# EAGLE design Driver (EAGLE 7.7.0)

## Sheet 1 of 3: LOGIC
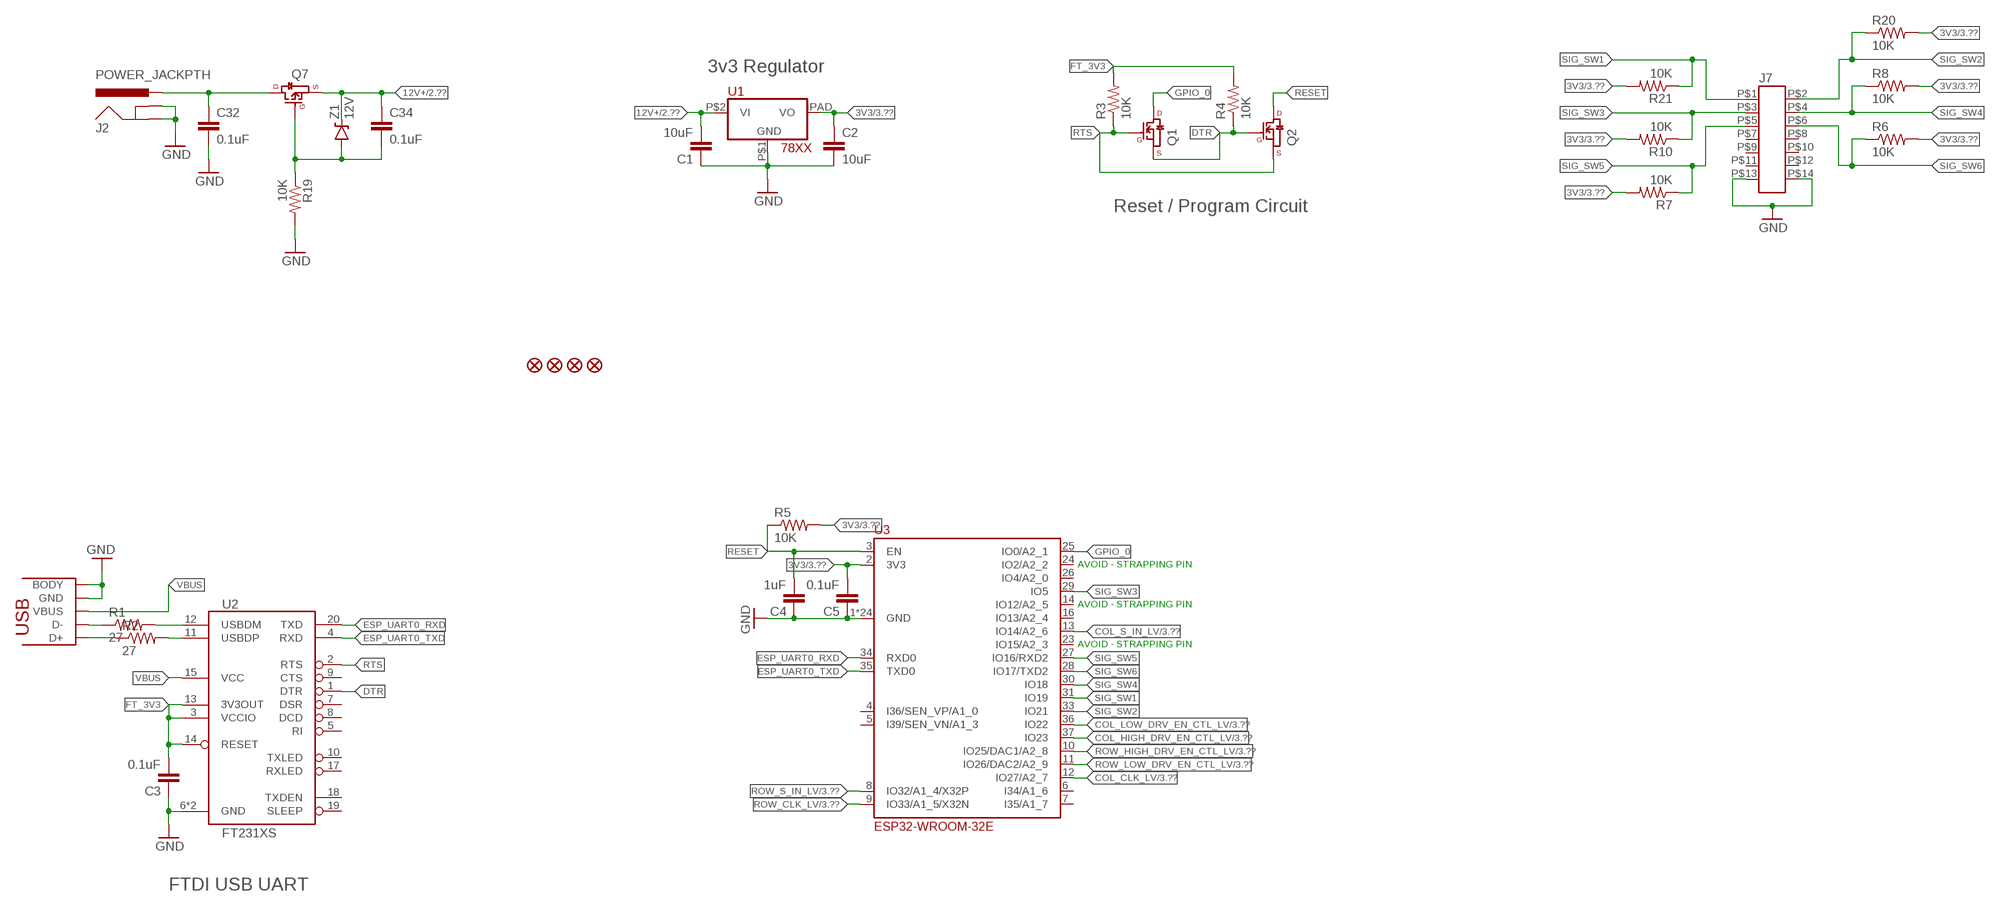
[diagram p0: schematic, sheet 1]

### Parts
C1  10uF  CAP1206  [1206]
C2  10uF  CAP1206  [1206]
C3  0.1uF  CAP0603-CAP  [0603-CAP]
C4  1uF  CAP0603-CAP  [0603-CAP]
C5  0.1uF  CAP0603-CAP  [0603-CAP]
C32  0.1uF  CAP0603-CAP  [0603-CAP]
C34  0.1uF  CAP0603-CAP  [0603-CAP]
FID1  FIDUCIAL  [FIDUCIAL]
FID2  FIDUCIAL  [FIDUCIAL]
FID3  FIDUCIAL  [FIDUCIAL]
FID4  FIDUCIAL  [FIDUCIAL]
J1  USB-MICROB  [USB-MICROB-10118192]
J2  POWER_JACKPTH  [POWER_JACK_PTH]
J7  HEADER-2X7  [3M-3000SERIES-HEADER-RIGHTANGLE]
Q1  MOSFET_N_CHANNELFDV305N  [SOT-23]
Q2  MOSFET_N_CHANNELFDV305N  [SOT-23]
Q7  MOSFET_P_CHANNELDMP4015SSS  [SO08]
R1  27  RESISTOR0603-RES  [0603-RES]
R2  27  RESISTOR0603-RES  [0603-RES]
R3  10K  RESISTOR0603-RES  [0603-RES]
R4  10K  RESISTOR0603-RES  [0603-RES]
R5  10K  RESISTOR0603-RES  [0603-RES]
R6  10K  RESISTOR0603-RES  [0603-RES]
R7  10K  RESISTOR0603-RES  [0603-RES]
R8  10K  RESISTOR0603-RES  [0603-RES]
R10  10K  RESISTOR0603-RES  [0603-RES]
R19  10K  RESISTOR0603-RES  [0603-RES]
R20  10K  RESISTOR0603-RES  [0603-RES]
R21  10K  RESISTOR0603-RES  [0603-RES]
U1  7805AZ1117_TO252  [DPAK-3]
U2  FT231XS  [SSOP-20]
U3  ESP32-WROOM-32E  [ESP32-WROOM-32E]
Z1  12V  DIODE-ZENERSOT-23  [SOT-23]

### Nets
3V3: C2.1 C5.2 R5.2 R6.2 R7.2 R8.2 R10.2 R20.2 R21.2 U1.PAD(VO) U3.2(3V3) ; also sheet 3
12V+: C1.2 C34.1 Q7.1(S) Q7.2(S) Q7.3(S) U1.P$2(VI) Z1.3(C) ; also sheet 2,3
COL_CLK_LV: U3.12(IO27/A2_7) ; also sheet 3
COL_HIGH_DRV_EN_CTL_LV: U3.37(IO23) ; also sheet 3
COL_LOW_DRV_EN_CTL_LV: U3.36(IO22) ; also sheet 3
COL_S_IN_LV: U3.13(IO14/A2_6) ; also sheet 3
DTR: Q1.2(S) Q2.1(G) R4.1 U2.1(DTR)
ESP_UART0_RXD: U2.20(TXD) U3.34(RXD0)
ESP_UART0_TXD: U2.4(RXD) U3.35(TXD0)
FT_3V3: C3.2 R3.2 R4.2 U2.3(VCCIO) U2.13(3V3OUT) U2.14(RESET)
GND: C1.1 C2.2 C3.1 C4.1 C5.1 C32.2 J1.5(GND) J1.BODY@1(BODY) J1.BODY@2(BODY) J1.BODY@3(BODY) J1.BODY@4(BODY) J1.BODY@5(BODY) J1.BODY@6(BODY) J2.GND J2.GNDBREAK J7.P$13 J7.P$14 R19.2 U1.P$1(GND) U2.6(GND) U2.16(GND) U3.1(GND) U3.15(GND) U3.38(GND) U3.P$1(GND) U3.P$2(GND) U3.P$3(GND) U3.P$4(GND) U3.P$5(GND) U3.P$6(GND) U3.P$7(GND) U3.P$8(GND) U3.P$9(GND) U3.P$10(GND) U3.P$11(GND) U3.P$12(GND) U3.PAD@1(GND) U3.PAD@2(GND) U3.PAD@3(GND) U3.PAD@4(GND) U3.PAD@5(GND) U3.PAD@6(GND) U3.PAD@7(GND) U3.PAD@8(GND) U3.PAD@9(GND) ; also sheet 2
GPIO_0: Q1.3(D) U3.25(IO0/A2_1)
N$7: J1.2(D-) R1.1
N$8: J1.3(D+) R2.1
N$17: R2.2 U2.11(USBDP)
N$18: R1.2 U2.12(USBDM)
N$25: C32.1 J2.PWR Q7.5(D) Q7.6(D) Q7.7(D) Q7.8(D)
N$27: C34.2 Q7.4(G) R19.1 Z1.1(A)
RESET: C4.2 Q2.3(D) R5.1 U3.3(EN)
ROW_CLK_LV: U3.9(IO33/A1_5/X32N) ; also sheet 3
ROW_HIGH_DRV_EN_CTL_LV: U3.10(IO25/DAC1/A2_8) ; also sheet 3
ROW_LOW_DRV_EN_CTL_LV: U3.11(IO26/DAC2/A2_9) ; also sheet 3
ROW_S_IN_LV: U3.8(IO32/A1_4/X32P) ; also sheet 3
RTS: Q1.1(G) Q2.2(S) R3.1 U2.2(RTS)
SIG_SW1: J7.P$1 R21.1 U3.31(IO19)
SIG_SW2: J7.P$2 R20.1 U3.33(IO21)
SIG_SW3: J7.P$3 R10.1 U3.29(IO5)
SIG_SW4: J7.P$4 R8.1 U3.30(IO18)
SIG_SW5: J7.P$5 R7.1 U3.27(IO16/RXD2)
SIG_SW6: J7.P$6 R6.1 U3.28(IO17/TXD2)
VBUS: J1.1(VBUS) U2.15(VCC)
Unconnected: J7.P$7 J7.P$8 J7.P$9 J7.P$10 J7.P$11 J7.P$12 U2.5(RI) U2.7(DSR) U2.8(DCD) U2.9(CTS) U2.10(TXLED) U2.17(RXLED) U2.18(TXDEN) U2.19(SLEEP) U3.4(I36/SEN_VP/A1_0) U3.5(I39/SEN_VN/A1_3) U3.6(I34/A1_6) U3.7(I35/A1_7) U3.14(IO12/A2_5) U3.16(IO13/A2_4) U3.23(IO15/A2_3) U3.24(IO2/A2_2) U3.26(IO4/A2_0)

### Notes on the sheet
- 3v3 Regulator
- Reset / Program Circuit
- AVOID - STRAPPING PIN
- AVOID - STRAPPING PIN
- AVOID - STRAPPING PIN
- FTDI USB UART

## Sheet 2 of 3: DRIVERS
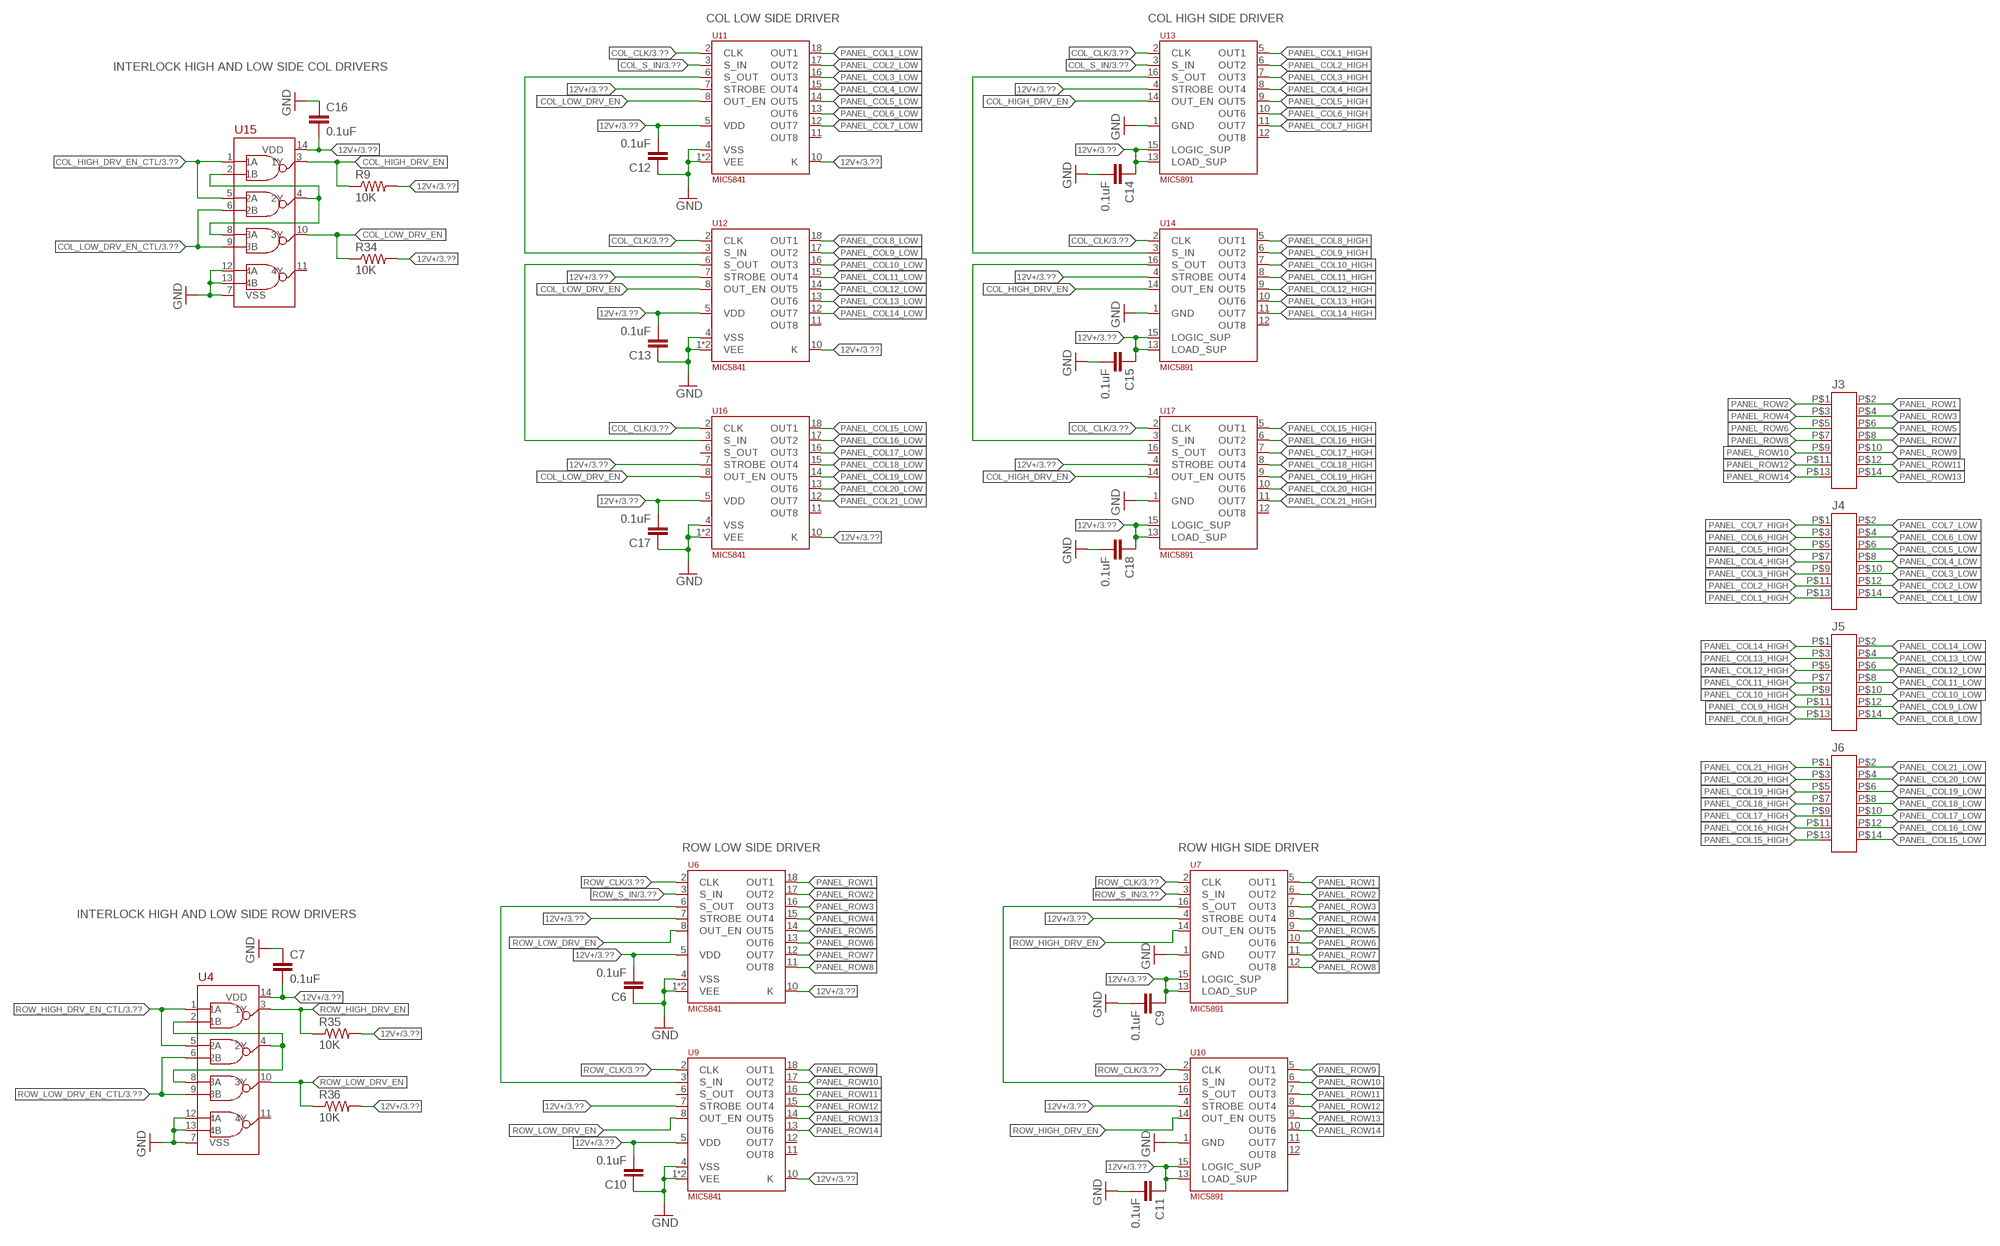
[diagram p1: schematic, sheet 2]

### Parts
C6  0.1uF  CAP0603-CAP  [0603-CAP]
C7  0.1uF  CAP0603-CAP  [0603-CAP]
C9  0.1uF  CAP0603-CAP  [0603-CAP]
C10  0.1uF  CAP0603-CAP  [0603-CAP]
C11  0.1uF  CAP0603-CAP  [0603-CAP]
C12  0.1uF  CAP0603-CAP  [0603-CAP]
C13  0.1uF  CAP0603-CAP  [0603-CAP]
C14  0.1uF  CAP0603-CAP  [0603-CAP]
C15  0.1uF  CAP0603-CAP  [0603-CAP]
C16  0.1uF  CAP0603-CAP  [0603-CAP]
C17  0.1uF  CAP0603-CAP  [0603-CAP]
C18  0.1uF  CAP0603-CAP  [0603-CAP]
J3  HEADER-2X7  [3M-3000SERIES-HEADER-RIGHTANGLE]
J4  HEADER-2X7  [3M-3000SERIES-HEADER-RIGHTANGLE]
J5  HEADER-2X7  [3M-3000SERIES-HEADER-RIGHTANGLE]
J6  HEADER-2X7  [3M-3000SERIES-HEADER-RIGHTANGLE]
R9  10K  RESISTOR0603-RES  [0603-RES]
R34  10K  RESISTOR0603-RES  [0603-RES]
R35  10K  RESISTOR0603-RES  [0603-RES]
R36  10K  RESISTOR0603-RES  [0603-RES]
U4  HEF4093B  [SOIC-14]
U6  MIC5841  [SOIC-18-WIDE]
U7  MIC5891  [SOIC-16-WIDE]
U9  MIC5841  [SOIC-18-WIDE]
U10  MIC5891  [SOIC-16-WIDE]
U11  MIC5841  [SOIC-18-WIDE]
U12  MIC5841  [SOIC-18-WIDE]
U13  MIC5891  [SOIC-16-WIDE]
U14  MIC5891  [SOIC-16-WIDE]
U15  HEF4093B  [SOIC-14]
U16  MIC5841  [SOIC-18-WIDE]
U17  MIC5891  [SOIC-16-WIDE]

### Nets
12V+: C6.2 C7.2 C9.1 C10.2 C11.1 C12.2 C13.2 C14.1 C15.1 C16.2 C17.2 C18.1 R9.2 R34.2 R35.2 R36.2 U4.14(VDD) U6.5(VDD) U6.7(STROBE) U6.10(K) U7.4(STROBE) U7.13(LOAD_SUP) U7.15(LOGIC_SUP) U9.5(VDD) U9.7(STROBE) U9.10(K) U10.4(STROBE) U10.13(LOAD_SUP) U10.15(LOGIC_SUP) U11.5(VDD) U11.7(STROBE) U11.10(K) U12.5(VDD) U12.7(STROBE) U12.10(K) U13.4(STROBE) U13.13(LOAD_SUP) U13.15(LOGIC_SUP) U14.4(STROBE) U14.13(LOAD_SUP) U14.15(LOGIC_SUP) U15.14(VDD) U16.5(VDD) U16.7(STROBE) U16.10(K) U17.4(STROBE) U17.13(LOAD_SUP) U17.15(LOGIC_SUP) ; also sheet 1,3
COL_CLK: U11.2(CLK) U12.2(CLK) U13.2(CLK) U14.2(CLK) U16.2(CLK) U17.2(CLK) ; also sheet 3
COL_HIGH_DRV_EN: R9.1 U13.14(OUT_EN) U14.14(OUT_EN) U15.3(1Y) U17.14(OUT_EN)
COL_HIGH_DRV_EN_CTL: U15.1(1A) U15.5(2A) ; also sheet 3
COL_LOW_DRV_EN: R34.1 U11.8(OUT_EN) U12.8(OUT_EN) U15.10(3Y) U16.8(OUT_EN)
COL_LOW_DRV_EN_CTL: U15.6(2B) U15.9(3B) ; also sheet 3
COL_S_IN: U11.3(S_IN) U13.3(S_IN) ; also sheet 3
GND: C6.1 C7.1 C9.2 C10.1 C11.2 C12.1 C13.1 C14.2 C15.2 C16.1 C17.1 C18.2 U4.7(VSS) U4.12(4A) U4.13(4B) U6.1(VEE) U6.4(VSS) U6.9(VEE) U7.1(GND) U9.1(VEE) U9.4(VSS) U9.9(VEE) U10.1(GND) U11.1(VEE) U11.4(VSS) U11.9(VEE) U12.1(VEE) U12.4(VSS) U12.9(VEE) U13.1(GND) U14.1(GND) U15.7(VSS) U15.12(4A) U15.13(4B) U16.1(VEE) U16.4(VSS) U16.9(VEE) U17.1(GND) ; also sheet 1
N$1: U6.6(S_OUT) U9.3(S_IN)
N$3: U4.2(1B) U4.4(2Y) U4.8(3A)
N$4: U7.16(S_OUT) U10.3(S_IN)
N$5: U11.6(S_OUT) U12.3(S_IN)
N$6: U13.16(S_OUT) U14.3(S_IN)
N$9: U15.2(1B) U15.4(2Y) U15.8(3A)
N$10: U12.6(S_OUT) U16.3(S_IN)
N$11: U14.16(S_OUT) U17.3(S_IN)
PANEL_COL1_HIGH: J4.P$13 U13.5(OUT1)
PANEL_COL1_LOW: J4.P$14 U11.18(OUT1)
PANEL_COL2_HIGH: J4.P$11 U13.6(OUT2)
PANEL_COL2_LOW: J4.P$12 U11.17(OUT2)
PANEL_COL3_HIGH: J4.P$9 U13.7(OUT3)
PANEL_COL3_LOW: J4.P$10 U11.16(OUT3)
PANEL_COL4_HIGH: J4.P$7 U13.8(OUT4)
PANEL_COL4_LOW: J4.P$8 U11.15(OUT4)
PANEL_COL5_HIGH: J4.P$5 U13.9(OUT5)
PANEL_COL5_LOW: J4.P$6 U11.14(OUT5)
PANEL_COL6_HIGH: J4.P$3 U13.10(OUT6)
PANEL_COL6_LOW: J4.P$4 U11.13(OUT6)
PANEL_COL7_HIGH: J4.P$1 U13.11(OUT7)
PANEL_COL7_LOW: J4.P$2 U11.12(OUT7)
PANEL_COL8_HIGH: J5.P$13 U14.5(OUT1)
PANEL_COL8_LOW: J5.P$14 U12.18(OUT1)
PANEL_COL9_HIGH: J5.P$11 U14.6(OUT2)
PANEL_COL9_LOW: J5.P$12 U12.17(OUT2)
PANEL_COL10_HIGH: J5.P$9 U14.7(OUT3)
PANEL_COL10_LOW: J5.P$10 U12.16(OUT3)
PANEL_COL11_HIGH: J5.P$7 U14.8(OUT4)
PANEL_COL11_LOW: J5.P$8 U12.15(OUT4)
PANEL_COL12_HIGH: J5.P$5 U14.9(OUT5)
PANEL_COL12_LOW: J5.P$6 U12.14(OUT5)
PANEL_COL13_HIGH: J5.P$3 U14.10(OUT6)
PANEL_COL13_LOW: J5.P$4 U12.13(OUT6)
PANEL_COL14_HIGH: J5.P$1 U14.11(OUT7)
PANEL_COL14_LOW: J5.P$2 U12.12(OUT7)
PANEL_COL15_HIGH: J6.P$13 U17.5(OUT1)
PANEL_COL15_LOW: J6.P$14 U16.18(OUT1)
PANEL_COL16_HIGH: J6.P$11 U17.6(OUT2)
PANEL_COL16_LOW: J6.P$12 U16.17(OUT2)
PANEL_COL17_HIGH: J6.P$9 U17.7(OUT3)
PANEL_COL17_LOW: J6.P$10 U16.16(OUT3)
PANEL_COL18_HIGH: J6.P$7 U17.8(OUT4)
PANEL_COL18_LOW: J6.P$8 U16.15(OUT4)
PANEL_COL19_HIGH: J6.P$5 U17.9(OUT5)
PANEL_COL19_LOW: J6.P$6 U16.14(OUT5)
PANEL_COL20_HIGH: J6.P$3 U17.10(OUT6)
PANEL_COL20_LOW: J6.P$4 U16.13(OUT6)
PANEL_COL21_HIGH: J6.P$1 U17.11(OUT7)
PANEL_COL21_LOW: J6.P$2 U16.12(OUT7)
PANEL_ROW1: J3.P$2 U6.18(OUT1) U7.5(OUT1)
PANEL_ROW2: J3.P$1 U6.17(OUT2) U7.6(OUT2)
PANEL_ROW3: J3.P$4 U6.16(OUT3) U7.7(OUT3)
PANEL_ROW4: J3.P$3 U6.15(OUT4) U7.8(OUT4)
PANEL_ROW5: J3.P$6 U6.14(OUT5) U7.9(OUT5)
PANEL_ROW6: J3.P$5 U6.13(OUT6) U7.10(OUT6)
PANEL_ROW7: J3.P$8 U6.12(OUT7) U7.11(OUT7)
PANEL_ROW8: J3.P$7 U6.11(OUT8) U7.12(OUT8)
PANEL_ROW9: J3.P$10 U9.18(OUT1) U10.5(OUT1)
PANEL_ROW10: J3.P$9 U9.17(OUT2) U10.6(OUT2)
PANEL_ROW11: J3.P$12 U9.16(OUT3) U10.7(OUT3)
PANEL_ROW12: J3.P$11 U9.15(OUT4) U10.8(OUT4)
PANEL_ROW13: J3.P$14 U9.14(OUT5) U10.9(OUT5)
PANEL_ROW14: J3.P$13 U9.13(OUT6) U10.10(OUT6)
ROW_CLK: U6.2(CLK) U7.2(CLK) U9.2(CLK) U10.2(CLK) ; also sheet 3
ROW_HIGH_DRV_EN: R35.1 U4.3(1Y) U7.14(OUT_EN) U10.14(OUT_EN)
ROW_HIGH_DRV_EN_CTL: U4.1(1A) U4.5(2A) ; also sheet 3
ROW_LOW_DRV_EN: R36.1 U4.10(3Y) U6.8(OUT_EN) U9.8(OUT_EN)
ROW_LOW_DRV_EN_CTL: U4.6(2B) U4.9(3B) ; also sheet 3
ROW_S_IN: U6.3(S_IN) U7.3(S_IN) ; also sheet 3
Unconnected: U4.11(4Y) U9.6(S_OUT) U9.11(OUT8) U9.12(OUT7) U10.11(OUT7) U10.12(OUT8) U10.16(S_OUT) U11.11(OUT8) U12.11(OUT8) U13.12(OUT8) U14.12(OUT8) U15.11(4Y) U16.6(S_OUT) U16.11(OUT8) U17.12(OUT8) U17.16(S_OUT)

### Notes on the sheet
- COL LOW SIDE DRIVER | COL HIGH SIDE DRIVER
- INTERLOCK HIGH AND LOW SIDE COL DRIVERS
- ROW LOW SIDE DRIVER | ROW HIGH SIDE DRIVER
- INTERLOCK HIGH AND LOW SIDE ROW DRIVERS

## Sheet 3 of 3: LEVEL SHIFT
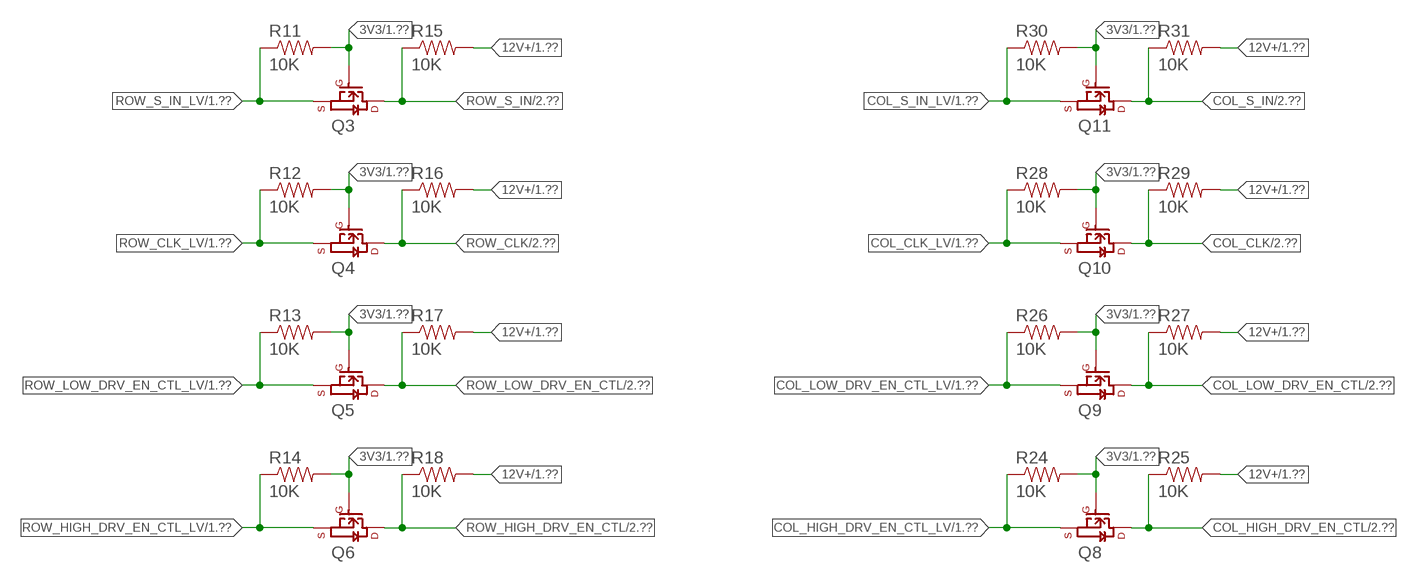
[diagram p2: schematic, sheet 3]

### Parts
Q3  MOSFET_N_CHANNELFDV305N  [SOT-23]
Q4  MOSFET_N_CHANNELFDV305N  [SOT-23]
Q5  MOSFET_N_CHANNELFDV305N  [SOT-23]
Q6  MOSFET_N_CHANNELFDV305N  [SOT-23]
Q8  MOSFET_N_CHANNELFDV305N  [SOT-23]
Q9  MOSFET_N_CHANNELFDV305N  [SOT-23]
Q10  MOSFET_N_CHANNELFDV305N  [SOT-23]
Q11  MOSFET_N_CHANNELFDV305N  [SOT-23]
R11  10K  RESISTOR0603-RES  [0603-RES]
R12  10K  RESISTOR0603-RES  [0603-RES]
R13  10K  RESISTOR0603-RES  [0603-RES]
R14  10K  RESISTOR0603-RES  [0603-RES]
R15  10K  RESISTOR0603-RES  [0603-RES]
R16  10K  RESISTOR0603-RES  [0603-RES]
R17  10K  RESISTOR0603-RES  [0603-RES]
R18  10K  RESISTOR0603-RES  [0603-RES]
R24  10K  RESISTOR0603-RES  [0603-RES]
R25  10K  RESISTOR0603-RES  [0603-RES]
R26  10K  RESISTOR0603-RES  [0603-RES]
R27  10K  RESISTOR0603-RES  [0603-RES]
R28  10K  RESISTOR0603-RES  [0603-RES]
R29  10K  RESISTOR0603-RES  [0603-RES]
R30  10K  RESISTOR0603-RES  [0603-RES]
R31  10K  RESISTOR0603-RES  [0603-RES]

### Nets
3V3: Q3.1(G) Q4.1(G) Q5.1(G) Q6.1(G) Q8.1(G) Q9.1(G) Q10.1(G) Q11.1(G) R11.2 R12.2 R13.2 R14.2 R24.2 R26.2 R28.2 R30.2 ; also sheet 1
12V+: R15.2 R16.2 R17.2 R18.2 R25.2 R27.2 R29.2 R31.2 ; also sheet 1,2
COL_CLK: Q10.3(D) R29.1 ; also sheet 2
COL_CLK_LV: Q10.2(S) R28.1 ; also sheet 1
COL_HIGH_DRV_EN_CTL: Q8.3(D) R25.1 ; also sheet 2
COL_HIGH_DRV_EN_CTL_LV: Q8.2(S) R24.1 ; also sheet 1
COL_LOW_DRV_EN_CTL: Q9.3(D) R27.1 ; also sheet 2
COL_LOW_DRV_EN_CTL_LV: Q9.2(S) R26.1 ; also sheet 1
COL_S_IN: Q11.3(D) R31.1 ; also sheet 2
COL_S_IN_LV: Q11.2(S) R30.1 ; also sheet 1
ROW_CLK: Q4.3(D) R16.1 ; also sheet 2
ROW_CLK_LV: Q4.2(S) R12.1 ; also sheet 1
ROW_HIGH_DRV_EN_CTL: Q6.3(D) R18.1 ; also sheet 2
ROW_HIGH_DRV_EN_CTL_LV: Q6.2(S) R14.1 ; also sheet 1
ROW_LOW_DRV_EN_CTL: Q5.3(D) R17.1 ; also sheet 2
ROW_LOW_DRV_EN_CTL_LV: Q5.2(S) R13.1 ; also sheet 1
ROW_S_IN: Q3.3(D) R15.1 ; also sheet 2
ROW_S_IN_LV: Q3.2(S) R11.1 ; also sheet 1

## Library data of the parts
C1-C7 C9-C18 C32 C34 = SparkFun:CAP: Capacitor Standard 0603 ceramic capacitor, and 0.1" leaded capacitor.
FID1-FID4 = Nigel:FIDUCIAL
J1 = Nigel:USB: USB Micro B Connector Ampehnol Part 10118192-0001LF
J2 = SparkFun:POWER_JACK: Power Jack This is the standard 5.5mm barrel jack for power. The PTH is the most common, proven, reliable, footprint. All others are experimental. The Slot footprint only works if the mill layer is transmitted to the PCB fab house so be warned. Spark Fun Electronics SKU : PRT-00119. Mating wall wart : TOL-00298 (and others)
J3-J7 = Nigel:HEADER-2X7
Q1-Q6 Q8-Q11 = Nigel:MOSFET_N_CHANNEL: N-Channel MOSFET
Q7 = Nigel:MOSFET_P_CHANNEL: P-Channel MOSFET
R1-R21 R24-R31 R34-R36 = SparkFun:RESISTOR: Resistor Basic schematic elements and footprints for 0603, 1206, and PTH resistors.
U1 = Nigel:7805: 7805 5V Regulator
U2 = Nigel:FT231XS: FT231XS USB to Full Handshake UART
U3 = Nigel:ESP32-WROOM-32E: ESP32-WROOM-32E
U4 U15 = Nigel:HEF4093B
U6 U9 U11 U12 U16 = Nigel:MIC5841
U7 U10 U13 U14 U17 = Nigel:MIC5891
Z1 = Nigel:DIODE-ZENER

## Board
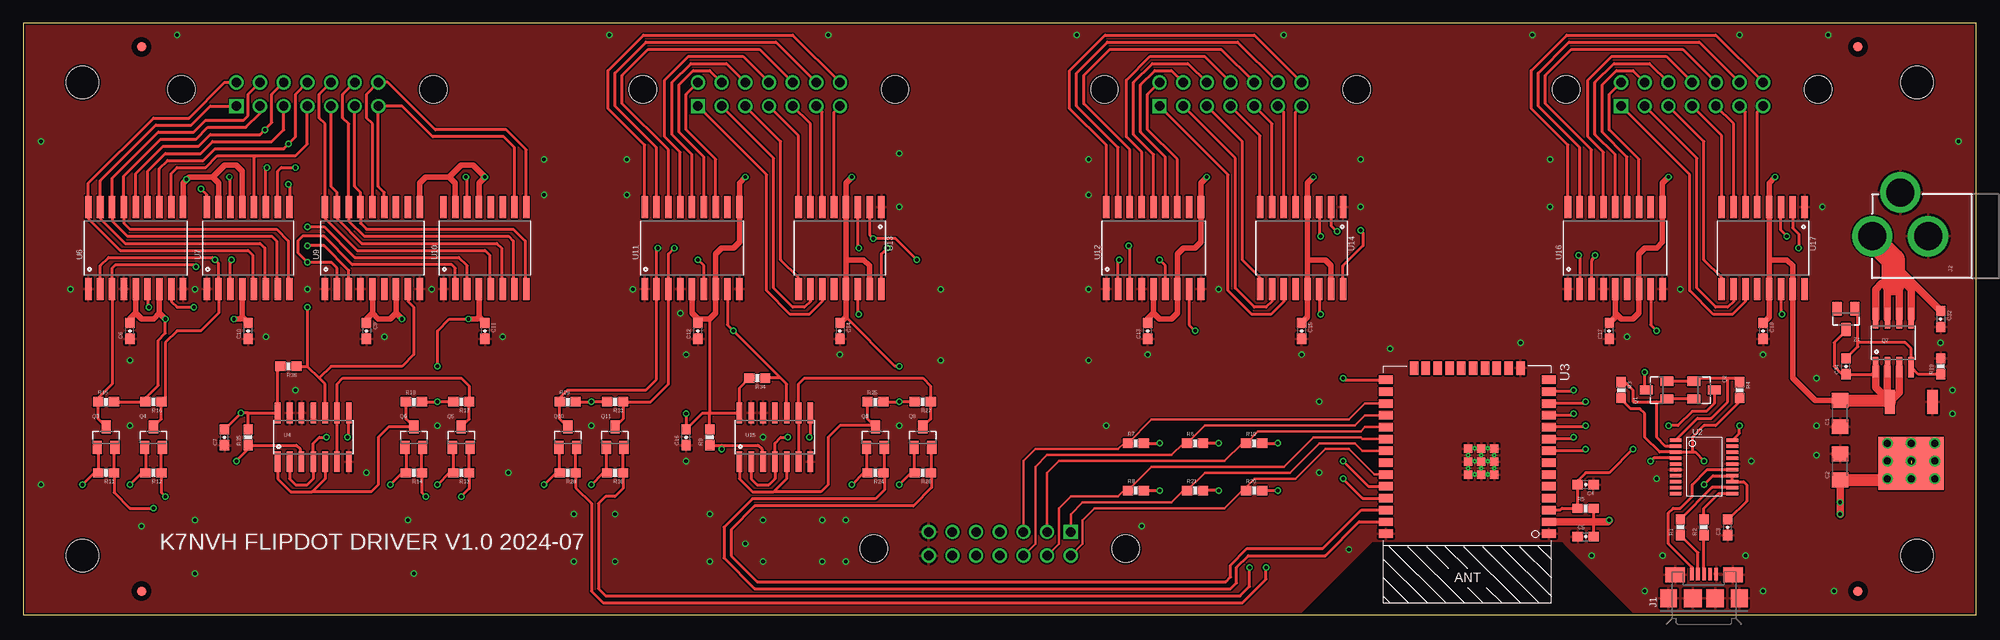
[diagram p3: board, top side]
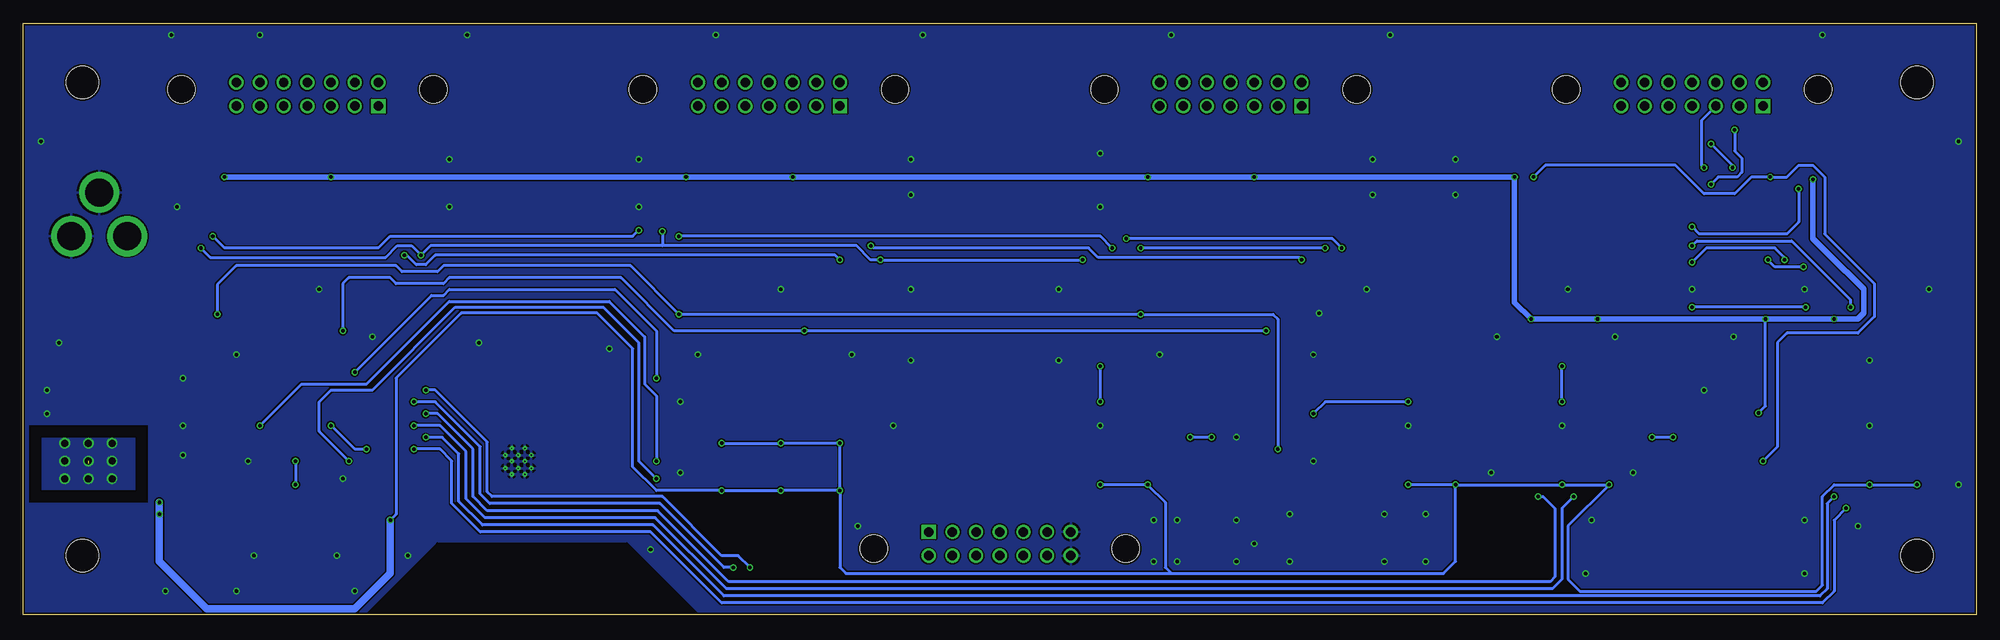
[diagram p4: board, bottom side, seen from below]

Size 209.55 x 63.5 mm. Coordinates in mm from the lower left corner, seen from the top.
Outline: 0,0 209.55,0 209.55,63.5 0,63.5 0,0
Copper layers (1*16): Top 0.0356mm / dielectric 1.5011mm / Bottom 0.0356mm
Design rules "JLCPCB *": minimum track width 5mil, minimum drill 6mil, track to track 6mil, track to pad 6mil, pad to pad 6mil, via to via 6mil, smd to smd 6mil, copper to edge 8mil, drill to drill 6mil, minimum pad ring 7mil, minimum via ring 6mil, stop-mask expansion 3mil, vias tented up to drill 12mil, thermal gap 10mil
Holes 3.51 mm at 6.35,6.35 6.35,57.15 203.2,57.15 203.2,6.35
tRestrict: area 137.2,0 to 172.7,7.6
bRestrict: area 137.2,0 to 172.7,7.6; area 196.2,19.1 to 208.9,20.3; area 207.6,12.1 to 208.9,20.3; area 196.2,12.1 to 208.9,13.3; area 196.2,12.1 to 197.5,20.3

### Footprints (pad centres in the part's own frame; a part is rotated, then mirrored left to right if it is on the bottom)
1206 = smd 1.6 x 1.8: 1 -1.4,0; 2 1.4,0
0603-CAP = smd 1.1 x 1: 1 -0.85,0; 2 0.85,0
FIDUCIAL = smd 1 x 1: 1 0,0
USB-MICROB-10118192 = smd 0.4 x 1.35: 1 -1.3,2.6; 2 -0.65,2.6; 3 0,2.6; 4 0.65,2.6; 5 1.3,2.6 | smd 1.8 x 1.9: BODY@1 -3.8,0; BODY@4 3.8,0 | smd 1.9 x 1.9: BODY@2 -1.2,0; BODY@3 1.2,0 | smd 2.1 x 1.6: BODY@5 -3.1,2.5; BODY@6 3.1,2.5
POWER_JACK_PTH = drill 2.997 pad 4.318: GND 0,7.7; GNDBREAK 4.7,10.7; PWR 0,13.7
3M-3000SERIES-HEADER-RIGHTANGLE = drill 1.016 square: P$1 -7.62,-1.27 | drill 1.016: P$2 -7.62,1.27; P$3 -5.08,-1.27; P$4 -5.08,1.27; P$5 -2.54,-1.27; P$6 -2.54,1.27; P$7 0,-1.27; P$8 0,1.27; P$9 2.54,-1.27; P$10 2.54,1.27; P$11 5.08,-1.27; P$12 5.08,1.27; P$13 7.62,-1.27; P$14 7.62,1.27 | hole 2.946: -13.525,0.533; 13.525,0.533
SOT-23 = smd 1 x 1.4: 1 -0.95,-1.1; 2 0.95,-1.1; 3 0,1.1
SO08 = smd 0.61 x 2.21: 1 -1.905,-2.616; 2 -0.635,-2.616; 3 0.635,-2.616; 4 1.905,-2.616; 5 1.905,2.616; 6 0.635,2.616; 7 -0.635,2.616; 8 -1.905,2.616
0603-RES = smd 1.1 x 1: 1 -0.85,0; 2 0.85,0
DPAK-3 = smd 1.1 x 2.6: P$1 -2.286,-2.54; P$2 2.286,-2.54 | smd 7 x 5.7: PAD 0,4.08
SSOP-20 = smd 0.381 x 1.27: 1 -2.223,-3.048; 2 -1.587,-3.048; 3 -0.953,-3.048; 4 -0.318,-3.048; 5 0.318,-3.048; 6 0.953,-3.048; 7 1.587,-3.048; 8 2.223,-3.048; 9 2.857,-3.048; 10 3.493,-3.048; 11 3.493,3.048; 12 2.857,3.048; 13 2.223,3.048; 14 1.587,3.048; 15 0.953,3.048; 16 0.318,3.048; 17 -0.318,3.048; 18 -0.953,3.048; 19 -1.587,3.048; 20 -2.223,3.048
ESP32-WROOM-32E = smd 1.5 x 0.9: 1 -8.75,5.26; 2 -8.75,3.99; 3 -8.75,2.72; 4 -8.75,1.45; 5 -8.75,0.18; 6 -8.75,-1.09; 7 -8.75,-2.36; 8 -8.75,-3.63; 9 -8.75,-4.9; 10 -8.75,-6.17; 11 -8.75,-7.44; 12 -8.75,-8.71; 13 -8.75,-9.98; 14 -8.75,-11.25; 25 8.75,-11.25; 26 8.75,-9.98; 27 8.75,-8.71; 28 8.75,-7.44; 29 8.75,-6.17; 30 8.75,-4.9; 31 8.75,-3.63; 32 8.75,-2.36; 33 8.75,-1.09; 34 8.75,0.18; 35 8.75,1.45; 36 8.75,2.72; 37 8.75,3.99; 38 8.75,5.26 | smd 0.9 x 1.5: 15 -5.71,-12.5; 16 -4.44,-12.5; 17 -3.17,-12.5; 18 -1.9,-12.5; 19 -0.63,-12.5; 20 0.64,-12.5; 21 1.91,-12.5; 22 3.18,-12.5; 23 4.45,-12.5; 24 5.72,-12.5 | drill 0.13 pad 0.4: P$1 -0.8,-2.5; P$2 -2.2,-2.5; P$3 -2.2,-1.1; P$4 -0.8,-1.1; P$5 -2.2,-3.9; P$6 -0.8,-3.9; P$7 -2.9,-1.76; P$8 -1.5,-1.76; P$9 -0.1,-1.76; P$10 -1.5,-3.16; P$11 -2.9,-3.16; P$12 -0.1,-3.16 | smd 0.9 x 0.9: PAD@1 -1.5,-2.46; PAD@2 -0.1,-2.46; PAD@3 -0.1,-3.86; PAD@4 -1.5,-3.86; PAD@5 -2.9,-3.86; PAD@6 -2.9,-2.46; PAD@7 -2.9,-1.06; PAD@8 -1.5,-1.06; PAD@9 -0.1,-1.06
SOIC-14 = smd 0.61 x 2.21: 1 -4.445,-2.616; 2 -3.175,-2.616; 3 -1.905,-2.616; 4 -0.635,-2.616; 5 0.635,-2.616; 6 1.905,-2.616; 7 3.175,-2.616; 8 3.175,2.616; 9 1.905,2.616; 10 0.635,2.616; 11 -0.635,2.616; 12 -1.905,2.616; 13 -3.175,2.616; 14 -4.445,2.616
SOIC-18-WIDE = smd 0.7 x 2.4: 1 -4.445,-4.4; 2 -3.175,-4.4; 3 -1.905,-4.4; 4 -0.635,-4.4; 5 0.635,-4.4; 6 1.905,-4.4; 7 3.175,-4.4; 8 4.445,-4.4; 9 5.715,-4.4; 10 5.715,4.4; 11 4.445,4.4; 12 3.175,4.4; 13 1.905,4.4; 14 0.635,4.4; 15 -0.635,4.4; 16 -1.905,4.4; 17 -3.175,4.4; 18 -4.445,4.4
SOIC-16-WIDE = smd 0.7 x 2.4: 1 -4.445,-4.4; 2 -3.175,-4.4; 3 -1.905,-4.4; 4 -0.635,-4.4; 5 0.635,-4.4; 6 1.905,-4.4; 7 3.175,-4.4; 8 4.445,-4.4; 9 4.445,4.4; 10 3.175,4.4; 11 1.905,4.4; 12 0.635,4.4; 13 -0.635,4.4; 14 -1.905,4.4; 15 -3.175,4.4; 16 -4.445,4.4

### Placement (x,y rotation side)
C1  194.94,21.59 90 top
C2  194.94,15.88 90 top
C3  182.88,9.4 90 top
C4  167.64,13.97 180 top
C5  167.64,8.38 0 top
C6  11.43,30.48 90 top
C7  21.59,19.05 90 top
C9  36.83,30.48 270 top
C10  24.13,30.48 90 top
C11  49.53,30.48 270 top
C12  72.39,30.48 90 top
C13  120.65,30.48 90 top
C14  87.63,30.48 270 top
C15  137.16,30.48 270 top
C16  71.12,19.05 90 top
C17  170.18,30.48 90 top
C18  186.69,30.48 270 top
C32  205.74,31.75 270 top
C34  195.58,26.67 90 top
FID1  12.7,2.54 0 top
FID2  196.85,2.54 0 top
FID3  196.85,60.96 0 top
FID4  12.7,60.96 0 top
J1  180.34,1.78 0 top
J2  212.09,40.64 90 top
J3  30.48,55.88 0 top
J4  80.01,55.88 0 top
J5  129.54,55.88 0 top
J6  179.07,55.88 0 top
J7  104.78,7.62 180 top
Q1  175.26,24.13 90 top
Q2  180.34,24.13 270 top
Q3  8.89,19.05 0 top
Q4  13.97,19.05 0 top
Q5  46.99,19.05 0 top
Q6  41.91,19.05 0 top
Q7  200.66,29.21 0 top
Q8  91.44,19.05 0 top
Q9  96.52,19.05 0 top
Q10  58.42,19.05 0 top
Q11  63.5,19.05 0 top
R1  177.8,9.4 90 top
R2  180.34,9.4 90 top
R3  171.45,24.13 270 top
R4  184.15,24.13 270 top
R5  167.64,11.43 0 top
R6  125.73,18.41 0 top
R7  119.38,18.41 0 top
R8  119.38,13.34 0 top
R9  73.66,19.05 90 top
R10  132.08,18.41 0 top
R11  8.89,15.24 180 top
R12  13.97,15.24 180 top
R13  46.99,15.24 180 top
R14  41.91,15.24 180 top
R15  8.89,22.86 0 top
R16  13.97,22.86 180 top
R17  46.99,22.86 180 top
R18  41.91,22.86 0 top
R19  205.74,26.67 90 top
R20  132.08,13.34 0 top
R21  125.73,13.34 0 top
R24  91.44,15.24 180 top
R25  91.44,22.86 0 top
R26  96.52,15.24 180 top
R27  96.52,22.86 180 top
R28  58.42,15.24 180 top
R29  58.42,22.86 0 top
R30  63.5,15.24 180 top
R31  63.5,22.86 180 top
R34  78.74,25.4 180 top
R35  24.13,19.05 90 top
R36  28.45,26.67 180 top
U1  202.56,20.32 180 top
U2  180.34,16.51 270 top
U3  154.94,13.97 180 top
U4  31.75,19.05 0 top
U6  11.43,39.37 0 top
U7  24.13,39.37 0 top
U9  36.83,39.37 0 top
U10  49.53,39.37 0 top
U11  71.12,39.37 0 top
U12  120.65,39.37 0 top
U13  87.63,39.37 180 top
U14  137.16,39.37 180 top
U15  81.28,19.05 0 top
U16  170.18,39.37 0 top
U17  186.69,39.37 180 top
Z1  195.58,31.75 180 top

### Tracks (layer width: path | path; a pad name or v marks a point on that pad's centre or on a via)
3V3  (via drill 0.38, 0.76)  (1 unrouted)
  Top 0.305: Q3.1 8.04,17.85 R11.2 7.62,15.24 v6.35,13.97 | Q4.1 13.12,17.85 R12.2 12.7,15.24 v11.43,13.97 | Q5.1 46.14,17.85 R13.2 45.72,15.24 v44.45,13.97 | Q6.1 41.06,17.85 R14.2 40.64,15.24 v39.37,13.97 | Q10.1 57.47,15.34 R28.2 57.15,15.24 v55.88,13.97 | Q11.1 62.55,15.34 R30.2 62.23,15.24 v60.96,13.97 | Q9.1 95.57,15.34 R26.2 95.25,15.24 v93.98,13.97 | Q8.1 90.49,15.34 R24.2 90.17,15.24 v88.9,13.97 | C5.2 168.49,9.56 168.91,9.98 168.49,10.4 R5.2 | v128.27,13.34 R21.2 | R20.2 v134.62,13.34 | R7.2 v121.92,18.41 | v128.27,18.41 R6.2 | R10.2 v134.62,18.41 | R8.2 v121.92,13.34 | v170.18,10.16 169.72,10.16 169.54,9.98
  Top 0.813: U3.2 168.91,9.98 169.54,9.98 170,9.98 v170.18,10.16 | v194.94,10.79 C2.1
  Top 1.27: C2.1 200.8,14.47 U1.PAD
  Bottom 0.305: v93.98,13.97 v88.9,13.97 87,12.06 87,5.08 86.36,4.45 | v55.88,13.97 v60.96,13.97 | v6.35,13.97 v11.43,13.97 15.24,13.97 16.51,12.7 16.51,3.17 17.14,2.54 42.55,2.54 43.81,3.81 43.81,9.53 v39.37,13.97 v44.45,13.97 v55.88,13.97 | v134.62,18.41 v128.27,18.41 v121.92,18.41 v121.92,13.34 | v121.92,13.34 v128.27,13.34 v134.62,13.34 141.6,13.34 144.15,15.88 144.15,28.57 147.96,32.38 162.56,32.38 169.54,25.4 169.54,10.79 v170.18,10.16 | 86.36,4.45 57.15,4.45 55.88,5.71 v55.88,13.97 | v121.92,13.34 121.92,5.08 121.28,4.45 86.36,4.45
  Bottom 0.813: v170.18,10.16 170.18,4.45 173.99,0.64 189.87,0.64 194.94,5.71 v194.94,10.79 v194.94,12.06
  other vias: 202.56,16.51 205.1,16.51 200.03,16.51 200.03,18.41 200.03,14.61 202.56,18.41 202.56,14.61 205.1,14.61 205.1,18.41
  pour Bottom: 197.49,19.05 207.65,19.05 207.65,13.34 197.49,13.34
12V+  (via drill 0.38)
  Top 0.305: C7.2 v23.36,21.67 24.13,21.67 | 24.13,21.67 U4.14 27.3,26.38 R36.2 | R35.2 24.13,21.67 | 73.66,21.67 72.89,21.67 C16.2 v71.12,21.59 | 73.66,21.67 U15.14 76.83,24.34 R34.2 | R9.2 73.66,21.67 | 73.66,31.75 73.66,21.67 | Z1.3 195.58,30.48 194.31,29.21 194.31,26.67 195.16,25.82 C34.1 198.34,25.82 198.75,26.24 Q7.1 | R15.2 R16.2 13.12,23.28 14.48,24.64 14.48,29.46 15.24,30.23 v15.24,31.75 | R18.2 v44.45,22.86 R17.2 | v44.45,26.67 44.45,30.48 45.72,31.75 48.26,31.75 | R29.2 v60.96,22.86 R31.2 | R25.2 v93.98,22.86 R27.2 | v93.98,26.67 93.56,26.67 88.27,31.96
  Top 0.61: U6.10 17.14,46.35 v17.53,46.74 17.78,46.99 20.32,46.99 | U7.15 20.95,46.35 20.32,46.99 | U9.10 42.55,46.35 43.18,46.99 45.72,46.99 | U10.15 46.35,46.35 45.72,46.99 | U7.13 23.5,47.62 22.86,48.26 21.59,48.26 20.32,46.99 | 45.72,46.99 46.99,48.26 48.26,48.26 v49.53,46.99 48.9,46.35 U10.13 | C14.1 88.27,31.96 U13.13 88.27,38.1 | C15.1 137.79,31.96 U14.13 137.79,38.1 | C18.1 187.32,31.96 U17.13 187.32,38.1 | 137.79,38.1 U14.4 137.79,46.35 v138.43,46.99 | 88.27,38.1 U13.4 88.27,46.35 v88.9,46.99 | 187.32,38.1 U17.4 187.32,46.35 v187.96,46.99 | U16.5 170.81,32.38 | 170.81,32.38 171.45,31.75 172.72,31.75 173.35,32.38 U16.7 173.35,38.73 173.99,39.37 175.26,39.37 175.9,40.01 U16.10 175.9,46.35 v176.53,46.99 | C17.2 170.81,31.96 170.81,32.38 | U12.5 121.28,32.38 | 121.28,32.38 121.92,31.75 123.19,31.75 123.83,32.38 U12.7 123.83,38.73 124.46,39.37 125.73,39.37 126.36,40.01 U12.10 126.36,46.35 v127,46.99 | C13.2 120.65,31.75 121.28,32.38 | U11.5 71.75,32.38 72.39,31.75 | 72.39,31.75 73.66,31.75 74.3,32.38 U11.7 74.3,38.73 74.93,39.37 76.2,39.37 76.83,40.01 U11.10 76.83,46.35 v77.47,46.99 | U6.5 12.06,32.38 | 12.06,32.38 12.7,31.75 13.97,31.75 14.61,32.38 | U9.5 37.47,32.38 | 37.47,32.38 38.1,31.75 39.37,31.75 40.01,32.38 | C9.1 36.83,31.75 37.47,32.38 | C6.2 11.43,31.75 12.06,32.38 | U7.4 23.5,31.96 | 23.5,31.96 C10.2 | U10.4 48.9,31.96 | 48.9,31.96 C11.1 | 14.61,32.38 v15.24,31.75 | U6.7 14.61,32.38 | 40.01,32.38 v40.64,31.75 | v47.75,31.75 48.26,31.75 48.68,31.75 48.9,31.96 | U9.7 40.01,32.38 | 23.5,31.96 23.28,31.75 v22.61,31.75 | U13.15 90.81,37.47 90.17,38.1 88.27,38.1 | U14.15 140.34,37.47 139.7,38.1 137.79,38.1
  Top 0.61: 187.32,38.1 189.23,38.1 189.87,37.47 U17.15 189.87,25.4 192.28,22.99 C1.2 | C12.2 72.39,31.75
  Top 0.813: Q7.1 198.75,24.38 U1.P$2 | Q7.2 200.03,23.11 U1.P$2 | Q7.3 201.29,23.88 U1.P$2
  Top 1.27: C1.2 200.15,22.99 U1.P$2
  Bottom 0.305: v23.36,21.67 22.61,22.42 v22.61,31.75 | v44.45,22.86 v44.45,26.67 | v60.96,22.86 69.85,22.86 v71.12,21.59 | v93.98,22.86 v93.98,26.67
  Bottom 0.61: v187.96,46.99 v176.53,46.99 v138.43,46.99 v127,46.99 v88.9,46.99 v77.47,46.99 v49.53,46.99 49.53,33.53 v47.75,31.75 v40.64,31.75 v22.61,31.75 v15.24,31.75 12.7,31.75 12.06,32.38 U6.5 13.93,36.83 13.97,36.83 17.53,40.39 v17.53,46.74
COL_CLK  (via drill 0.38)
  Top 0.305: v68.07,39.37 67.94,39.24 U11.2 67.94,25.27 66.8,24.13 58.42,24.13 57.57,23.28 R29.1 57.57,21 Q10.3 | v91.19,40.39 90.93,40.64 | U13.2 90.81,40.77 v91.19,40.39 | U12.2 117.47,37.97 v117.6,38.1 | v140.97,41.15 140.34,41.78 U14.2 | v166.88,38.61 167,38.48 U16.2 | U17.2 189.87,41.53 190.5,40.89 v190.5,39.37 | v95.89,38.1 93.6,40.39 v91.19,40.39
  Bottom 0.305: v68.07,39.37 69.09,40.39 v91.19,40.39 | 140.97,39.62 120.14,39.62 118.62,38.1 v117.6,38.1 v95.89,38.1 | 140.97,39.62 165.86,39.62 v166.88,38.61 167.89,39.62 169.42,39.62 170.69,38.35 189.48,38.35 v190.5,39.37 | v140.97,41.15 140.97,39.62
COL_CLK_LV  (via drill 0.38)
  Top 0.305: Q10.2 59.27,17.85 R28.1 59.27,13.63 60.96,11.94 60.96,2.54 62.23,1.27 130.81,1.27 133.35,3.81 v133.35,5.08 | v167.64,22.86 167.46,22.68 U3.12
  Bottom 0.305: v133.35,5.08 134.37,5.08 141.22,11.94 159.51,11.94 160.53,12.95 160.53,18.03 165.35,22.86 v167.64,22.86
COL_HIGH_DRV_EN  (via drill 0.38)
  Top 0.305: U13.14 89.53,32.38 v89.66,32.26 | U17.14 188.59,32.38 v188.72,32.26 | U14.14 139.06,32.38 v139.19,32.26 | R9.1 74.93,18.2 | 74.93,18.2 78.83,18.2 79.25,17.78 79.25,16.56 U15.3 | v74.93,17.78 74.93,18.2
  Bottom 0.305: v74.93,17.78 74.93,31.75 75.44,32.26 v89.66,32.26 v139.19,32.26 144.4,37.47 164.47,37.47 165.1,36.83 168.91,36.83 169.54,37.47 186.69,37.47 188.72,35.43 v188.72,32.26
COL_HIGH_DRV_EN_CTL
  Top 0.305: U15.1 76.83,14.61 78.23,13.21 80.52,13.21 | U15.5 81.92,14.61 80.52,13.21 | 80.52,13.21 85.6,13.21 86.36,13.97 86.36,19.05 87.63,20.32 91.27,20.32 Q8.3 90.59,21 R25.1
COL_HIGH_DRV_EN_CTL_LV
  Top 0.305: 92.39,15.34 R24.1 | 92.39,15.34 92.39,13.4 91.44,12.45 78.23,12.45 75.18,9.4 75.18,6.1 78.49,2.79 129.54,2.79 130.18,3.43 130.18,5.08 131.44,6.35 139.7,6.35 143.33,9.98 U3.37 | 92.39,15.34 Q8.2
COL_LOW_DRV_EN  (via drill 0.38)
  Top 0.305: U11.8 75.56,31.11 v76.2,30.48 81.28,25.4 | U16.8 174.62,31.11 v175.26,30.48 | U12.8 125.09,31.11 v125.73,30.48 | U15.10 81.92,24.77 81.28,25.4 | 81.28,25.4 R34.1
  Bottom 0.305: v76.2,30.48 v125.73,30.48 139.7,30.48 145.41,36.2 163.83,36.2 164.47,35.56 169.54,35.56 170.18,36.2 174.62,36.2 175.26,35.56 v175.26,30.48
COL_LOW_DRV_EN_CTL
  Top 0.305: U15.6 U15.9 83.19,24.77 83.82,25.4 96.52,25.4 97.37,24.55 R27.1 97.37,21 Q9.3
COL_LOW_DRV_EN_CTL_LV
  Top 0.305: 97.47,15.34 R26.1 | 97.47,15.34 97.47,13.65 95.5,11.68 78.49,11.68 75.95,9.14 75.95,6.35 78.74,3.56 129.03,3.56 129.54,4.06 129.54,5.33 131.32,7.11 139.45,7.11 143.58,11.25 U3.36 | 97.47,15.34 Q9.2
COL_S_IN  (via drill 0.38)
  Top 0.305: v69.85,39.37 69.22,38.73 U11.3 69.22,24.77 67.31,22.86 R31.1 64.35,21 Q11.3 | 89.66,39.62 v89.66,39.37 89.53,39.5 U13.3
  Bottom 0.305: v69.85,39.37 v89.66,39.37
COL_S_IN_LV  (via drill 0.38)
  Top 0.305: Q11.2 64.35,17.85 R30.1 64.35,13.55 63.5,12.7 62.48,12.7 61.72,11.94 61.72,2.79 62.48,2.03 130.56,2.03 131.57,3.05 v131.57,5.08 | v166.37,24.13 166.19,23.95 U3.13
  Bottom 0.305: v131.57,5.08 132.84,6.35 134.62,6.35 140.97,12.7 159.26,12.7 159.77,13.21 159.77,18.54 165.35,24.13 v166.37,24.13
DTR
  Top 0.305: Q1.2 Q2.1 179.56,25.4 182.88,25.4 | 182.88,25.4 183.73,25.4 R4.1 | U2.1 179.64,21.08 181.1,21.08 182.88,22.86 182.88,25.4
ESP_UART0_RXD  (via drill 0.38)
  Top 0.305: U2.20 184.15,19.49 v184.15,20.32 | v141.6,16.51 144.32,13.79 U3.34
  Bottom 0.305: v184.15,20.32 179.71,24.77 172.72,24.77 163.83,33.66 146.69,33.66 142.88,29.84 142.88,24.77 141.6,23.5 v141.6,16.51
ESP_UART0_TXD  (via drill 0.38)
  Top 0.305: U2.4 174.94,16.83 v174.62,16.51 | v141.6,14.61 143.69,12.52 U3.35
  Bottom 0.305: v174.62,16.51 177.8,19.68 177.8,22.86 176.53,24.13 172.09,24.13 163.19,33.02 147.32,33.02 143.51,29.21 143.51,16.51 v141.6,14.61
FT_3V3  (via drill 0.38)
  Top 0.305: C3.2 182.97,10.25 184.91,12.19 184.91,13.97 184.59,14.29 U2.13 U2.14 181.29,14.92 v180.34,13.97 | 179.07,17.46 U2.3 175.58,17.46 173.99,19.05 173.99,21.59 173.48,22.1 172.47,22.1 171.45,23.11 R3.2 | 179.07,17.46 179.39,17.46 v180.34,16.51 | R4.2 184.15,22.86 181.61,20.32 180.34,20.32 179.07,19.05 179.07,17.46
  Bottom 0.305: v180.34,16.51 v180.34,13.97
GND  (via drill 0.38)
  other vias: 71.12,27.94 29.21,24.13 36.83,15.24 63.5,10.79 59.05,10.79 59.05,5.71 63.5,5.71 79.38,10.16 77.47,7.62 79.38,5.71 73.66,5.71 73.66,10.79 88.27,10.16 88.27,5.71 85.72,5.71 85.72,10.16 41.91,4.45 41.27,10.16 18.41,4.45 18.41,10.16 12.7,9.53 1.91,13.97 186.69,2.54 173.99,2.54 175.9,6.35 184.78,6.35 175.26,14.61 185.42,16.51 192.41,20.32 192.41,17.14 207.01,24.13 207.01,21.59 205.74,29.21 192.41,25.4 186.69,27.94 193.04,43.81 207.65,50.8 193.68,62.23 184.15,62.23 161.93,62.23 135.25,62.23 113.03,62.23 86.36,62.23 62.87,62.23 16.51,62.23 1.91,50.8 5.08,34.92 11.43,27.3 18.41,34.92 30.48,34.92 43.81,34.92 38.73,29.84 65.41,34.92 70.48,32.38 93.98,43.81 93.98,49.53 64.77,48.9 64.77,45.09 55.88,48.9 55.88,45.09 114.3,48.9 114.3,45.09 143.51,43.81 143.51,48.9 114.3,34.92 128.27,34.92 163.83,43.81 163.83,48.9 177.8,34.92 172.09,29.84 168.28,6.35 142.24,6.99 160.66,29.21 137.16,27.94 120.65,27.94 71.12,16.51 79.38,19.05 44.45,20.32 51.44,29.84 87.63,27.94 26.04,29.84 93.98,20.32 52.07,15.24 116.2,20.32 120.02,9.53 139.06,15.24 139.06,22.86 146.69,28.57 194.31,2.54 11.43,20.32 60.96,20.32 98.42,34.92 98.42,27.3 114.3,27.3
  pour Top: 0,63.5 209.55,63.5 209.55,0 0,0
  pour Bottom: 0,63.5 209.55,63.5 209.55,0 0,0
GPIO_0  (via drill 0.38)
  Top 0.305: Q1.3 173.99,24.3 v173.99,26.04 | v141.6,25.4 141.78,25.22 U3.25
  Bottom 0.305: v173.99,26.04 165.74,34.29 164.47,34.29 163.83,34.92 146.05,34.92 141.6,30.48 v141.6,25.4
N$1  (via drill 0.38)
  Top 0.305: U9.3 34.92,36.96 32.26,39.62 v30.48,39.62 | U6.6 13.34,33.15 v13.46,33.02
  Bottom 0.305: v30.48,39.62 29.97,40.13 19.81,40.13 13.46,33.78 v13.46,33.02
N$3  (via drill 0.38)
  Top 0.305: U4.2 28.57,14.61 29.21,13.97 30.48,13.97 31.11,14.61 U4.4 31.11,18.41 31.75,19.05 v32.51,19.05 | v34.8,19.05 34.92,19.18 U4.8
  Bottom 0.305: v32.51,19.05 v34.8,19.05
N$4  (via drill 0.38)
  Top 0.305: U7.16 19.68,45.09 v19.05,45.72 | v30.48,41.66 32.26,41.66 35.56,38.35 46.74,38.35 47.62,37.47 U10.3
  Bottom 0.305: v19.05,45.72 19.05,42.16 20.32,40.89 29.72,40.89 v30.48,41.66
N$5  (via drill 0.38)
  Top 0.305: U11.6 73.03,37.47 v72.39,38.1 | U12.3 118.75,39.5 v118.62,39.62
  Bottom 0.305: v72.39,38.1 72.64,38.35 94.23,38.35 95.25,39.37 118.36,39.37 v118.62,39.62
N$6  (via drill 0.38)
  Top 0.305: U13.16 92.08,38.73 v92.71,39.37 | v139.19,40.64 139.06,40.77 U14.3
  Bottom 0.305: v92.71,39.37 93.98,40.64 v139.19,40.64
N$7
  Top 0.305: J1.2 179.69,6.66 R1.1
N$8
  Top 0.305: J1.3 R2.1
N$9  (via drill 0.38)
  Top 0.305: U15.2 78.11,14.61 78.74,13.97 80.01,13.97 80.64,14.61 U15.4 80.64,18.41 81.28,19.05 v82.04,19.05 | v84.33,19.05 84.45,19.18 U15.8
  Bottom 0.305: v82.04,19.05 v84.33,19.05
N$10  (via drill 0.38)
  Top 0.305: U12.6 122.56,37.47 v121.92,38.1 | v168.66,38.61 168.28,37.97 U16.3
  Bottom 0.305: v121.92,38.1 122.43,38.61 165.35,38.61 166.37,37.59 167.39,37.59 168.4,38.61 v168.66,38.61
N$11  (via drill 0.38)
  Top 0.305: U14.16 141.6,37.47 143.76,39.62 143.76,41.02 v143.51,41.27 | v189.23,40.64 188.59,41.27 U17.3
  Bottom 0.305: v189.23,40.64 187.96,39.37 171.45,39.37 170.18,40.64 144.15,40.64 v143.51,41.27
N$17
  Top 0.305: R2.2 180.34,11.43 181.93,13.02 U2.11
N$18
  Top 0.305: U2.12 181.2,13.65 R1.2
N$25
  Top 0.813: Q7.8 198.75,34.92 199.39,35.56 200.66,35.56 | Q7.5 202.56,34.92 201.93,35.56 200.66,35.56 | Q7.7 200.03,34.92 200.66,35.56 | Q7.6 201.29,34.92 200.66,35.56 | C32.1 201.51,36.83 200.66,36.83
  Top 2.54: J2.PWR 198.39,40.37 200.66,38.1 200.66,36.83 200.66,35.56
N$27
  Top 0.305: C34.2 196.85,28.79 196.85,29.21 | 196.85,29.21 196.85,32.53 Z1.1 | 196.85,29.21 201.93,29.21 202.56,28.57 Q7.4 203.34,25.82 R19.1
PANEL_COL1_HIGH
  Top 0.305: U13.5 87,53.98 J4.P$13
PANEL_COL1_LOW
  Top 0.305: J4.P$14 82.55,62.23 66.55,62.23 62.74,58.42 62.74,54.36 66.67,50.42 U11.18
PANEL_COL2_HIGH
  Top 0.305: U13.6 85.72,53.98 J4.P$11
PANEL_COL2_LOW
  Top 0.305: J4.P$12 80.77,61.47 66.8,61.47 63.5,58.17 63.5,54.61 67.94,50.16 U11.17
PANEL_COL3_HIGH
  Top 0.305: U13.7 84.45,52.7 J4.P$9
PANEL_COL3_LOW
  Top 0.305: J4.P$10 78.99,60.71 67.06,60.71 64.26,57.91 64.26,54.86 69.22,49.91 U11.16
PANEL_COL4_HIGH
  Top 0.305: U13.8 83.19,51.44 J4.P$7
PANEL_COL4_LOW
  Top 0.305: J4.P$8 77.22,59.94 71.37,59.94 68.83,57.4 68.83,51.31 70.48,49.66 U11.15
PANEL_COL5_HIGH
  Top 0.305: U13.9 83.19,36.2 81.28,38.1 81.28,50.8 J4.P$5
PANEL_COL5_LOW
  Top 0.305: J4.P$6 75.44,59.18 71.63,59.18 69.6,57.15 69.6,51.56 71.75,49.4 U11.14
PANEL_COL6_HIGH
  Top 0.305: U13.10 84.45,33.66 83.82,33.02 82.55,33.02 80.52,35.05 80.52,49.02 J4.P$3
PANEL_COL6_LOW
  Top 0.305: J4.P$4 73.66,58.42 71.88,58.42 70.36,56.9 70.36,51.82 73.03,49.15 U11.13
PANEL_COL7_HIGH
  Top 0.305: U13.11 85.72,33.66 84.33,32.26 82.3,32.26 79.76,34.8 79.76,47.24 J4.P$1
PANEL_COL7_LOW
  Top 0.305: J4.P$2 71.12,55.88 71.12,52.07 74.3,48.9 U11.12
PANEL_COL8_HIGH
  Top 0.305: U14.5 136.53,53.98 J5.P$13
PANEL_COL8_LOW
  Top 0.305: U12.18 116.2,50.42 112.27,54.36 112.27,58.42 116.08,62.23 132.08,62.23 J5.P$14
PANEL_COL9_HIGH
  Top 0.305: U14.6 135.25,53.98 J5.P$11
PANEL_COL9_LOW
  Top 0.305: U12.17 117.47,50.16 113.03,54.61 113.03,58.17 116.33,61.47 130.3,61.47 J5.P$12
PANEL_COL10_HIGH
  Top 0.305: U14.7 133.99,52.7 J5.P$9
PANEL_COL10_LOW
  Top 0.305: U12.16 118.75,49.91 113.79,54.86 113.79,57.91 116.59,60.71 128.52,60.71 J5.P$10
PANEL_COL11_HIGH
  Top 0.305: U14.8 132.72,51.44 J5.P$7
PANEL_COL11_LOW
  Top 0.305: U12.15 120.02,49.66 118.36,51.31 118.36,57.4 120.9,59.94 126.75,59.94 J5.P$8
PANEL_COL12_HIGH
  Top 0.305: U14.9 132.72,36.2 130.81,38.1 130.81,50.8 J5.P$5
PANEL_COL12_LOW
  Top 0.305: U12.14 121.28,49.4 119.13,51.56 119.13,57.15 121.16,59.18 124.97,59.18 J5.P$6
PANEL_COL13_HIGH
  Top 0.305: U14.10 133.99,33.66 133.35,33.02 132.08,33.02 130.05,35.05 130.05,49.02 J5.P$3
PANEL_COL13_LOW
  Top 0.305: U12.13 122.56,49.15 119.89,51.82 119.89,56.9 121.41,58.42 123.19,58.42 J5.P$4
PANEL_COL14_HIGH
  Top 0.305: U14.11 135.25,33.66 133.86,32.26 131.83,32.26 129.29,34.8 129.29,47.24 J5.P$1
PANEL_COL14_LOW
  Top 0.305: U12.12 123.83,48.9 120.65,52.07 120.65,55.88 J5.P$2
PANEL_COL15_HIGH
  Top 0.305: U17.5 186.06,53.98 J6.P$13
PANEL_COL15_LOW
  Top 0.305: U16.18 165.74,50.42 161.8,54.36 161.8,58.42 165.61,62.23 181.61,62.23 J6.P$14
PANEL_COL16_HIGH
  Top 0.305: U17.6 184.78,53.98 J6.P$11
PANEL_COL16_LOW
  Top 0.305: U16.17 167,50.16 162.56,54.61 162.56,58.17 165.86,61.47 179.83,61.47 J6.P$12
PANEL_COL17_HIGH
  Top 0.305: U17.7 183.51,52.7 J6.P$9
PANEL_COL17_LOW
  Top 0.305: U16.16 168.28,49.91 163.32,54.86 163.32,57.91 166.12,60.71 178.05,60.71 J6.P$10
PANEL_COL18_HIGH
  Top 0.305: U17.8 182.25,51.44 J6.P$7
PANEL_COL18_LOW
  Top 0.305: U16.15 169.54,49.66 167.89,51.31 167.89,57.4 170.43,59.94 176.28,59.94 J6.P$8
PANEL_COL19_HIGH
  Top 0.305: U17.9 182.25,36.2 180.34,38.1 180.34,50.8 J6.P$5
PANEL_COL19_LOW
  Top 0.305: U16.14 170.81,49.4 168.66,51.56 168.66,57.15 170.69,59.18 174.5,59.18 J6.P$6
PANEL_COL20_HIGH
  Top 0.305: U17.10 183.51,33.66 182.88,33.02 181.61,33.02 179.58,35.05 179.58,49.02 J6.P$3
PANEL_COL20_LOW
  Top 0.305: U16.13 172.09,49.15 169.42,51.82 169.42,56.9 170.94,58.42 172.72,58.42 J6.P$4
PANEL_COL21_HIGH
  Top 0.305: U17.11 184.78,33.66 183.39,32.26 181.36,32.26 178.82,34.8 178.82,47.24 J6.P$1
PANEL_COL21_LOW
  Top 0.305: U16.12 173.35,48.9 170.18,52.07 170.18,55.88 J6.P$2
PANEL_ROW1
  Top 0.305: J3.P$2 21.59,57.15 17.78,53.34 13.97,53.34 6.99,46.35 U6.18 6.99,42.55 10.41,39.12 24.13,39.12 24.64,38.61 24.64,35.1 U7.5
PANEL_ROW2
  Top 0.305: J3.P$1 20.07,54.61 18.03,52.58 14.22,52.58 8.26,46.61 U6.17 8.26,42.55 10.92,39.88 25.4,39.88 25.91,39.37 25.91,35.1 U7.6
PANEL_ROW3
  Top 0.305: J3.P$4 24.13,55.88 24.13,53.59 23.62,53.09 19.56,53.09 18.29,51.82 14.48,51.82 9.53,46.86 U6.16 9.53,42.29 11.18,40.64 26.67,40.64 27.18,40.13 27.18,35.1 U7.7
PANEL_ROW4
  Top 0.305: J3.P$3 25.4,53.85 23.88,52.32 19.81,52.32 18.54,51.05 14.73,51.05 10.79,47.12 U6.15 10.79,42.04 11.43,41.4 27.18,41.4 28.45,40.13 28.45,35.1 U7.8
PANEL_ROW5  (via drill 0.38)
  Top 0.305: U6.14 12.06,47.37 14.99,50.29 18.8,50.29 20.07,51.56 25.4,51.56 v25.91,52.07 26.67,52.83 26.67,55.88 J3.P$6 | v28.45,46.23 28.57,46.1 U7.9
  Bottom 0.305: v25.91,52.07 25.91,49.78 25.15,49.02 25.15,47.5 25.65,46.99 27.69,46.99 v28.45,46.23
PANEL_ROW6  (via drill 0.38)
  Top 0.305: U6.13 13.34,47.62 15.24,49.53 19.05,49.53 20.32,50.8 26.67,50.8 27.94,52.07 J3.P$5 | U7.10 27.3,47.62 27.69,48.01 v29.21,48.01
  Bottom 0.305: v29.21,48.01 29.46,48.26 29.46,53.09 J3.P$5
PANEL_ROW7  (via drill 0.38)
  Top 0.305: U6.12 14.61,47.88 15.49,48.77 19.3,48.77 20.57,50.04 27.94,50.04 v28.45,50.55 29.21,51.31 29.21,55.88 J3.P$8 | U7.11 26.04,47.88 v26.16,48.01
  Bottom 0.305: v26.16,48.01 26.16,48.26 v28.45,50.55
PANEL_ROW8
  Top 0.305: U6.11 15.88,47.37 16.51,48.01 19.56,48.01 20.83,49.28 24.89,49.28 | 24.89,49.28 29.21,49.28 30.48,50.55 J3.P$7 | U7.12 24.77,49.15 24.89,49.28
PANEL_ROW9
  Top 0.305: J3.P$10 31.75,55.88 31.75,53.34 32.38,52.7 U9.18 32.38,42.55 35.81,39.12 49.53,39.12 50.04,38.61 50.04,35.1 U10.5
PANEL_ROW10
  Top 0.305: J3.P$9 33.02,45.97 33.66,45.34 U9.17 33.66,42.55 36.32,39.88 50.8,39.88 51.31,39.37 51.31,35.1 U10.6
PANEL_ROW11
  Top 0.305: J3.P$12 34.29,55.88 34.29,53.34 34.92,52.7 U9.16 34.92,42.29 36.58,40.64 52.07,40.64 52.58,40.13 52.58,35.1 U10.7
PANEL_ROW12
  Top 0.305: J3.P$11 35.56,45.97 36.2,45.34 U9.15 36.2,42.04 36.83,41.4 52.58,41.4 53.85,40.13 53.85,35.1 U10.8
PANEL_ROW13
  Top 0.305: U9.14 37.47,52.7 36.83,53.34 36.83,55.88 J3.P$14 39.12,57.15 44.2,52.07 51.82,52.07 53.98,49.91 U10.9
PANEL_ROW14
  Top 0.305: U9.13 38.73,45.34 38.1,45.97 J3.P$13 40.64,54.61 43.94,51.31 51.56,51.31 52.7,50.16 U10.10
RESET  (via drill 0.38)
  Top 0.305: U3.3 164.92,11.25 165.1,11.43 R5.1 C4.2 166.79,14.39 167.64,15.24 170.18,15.24 v172.72,17.78 | Q2.3 181.44,22.69 180.59,21.84 179.07,21.84 177.55,20.32 v176.53,20.32
  Bottom 0.305: v176.53,20.32 173.99,17.78 v172.72,17.78
ROW_CLK  (via drill 0.38)
  Top 0.305: U6.2 8.26,37.47 9.14,38.35 20.32,38.35 v20.57,38.1 20.95,37.72 U7.2 20.95,32.38 19.05,30.48 16.51,30.48 15.24,29.21 15.24,23.28 R16.1 14.82,21 Q4.3 | U9.2 33.66,37.21 33.02,37.85 v30.48,37.85 29.46,38.86 29.46,40.13 29.97,40.64 32.26,40.64 35.31,37.59 45.97,37.59 46.35,37.21 U10.2
  Bottom 0.305: v20.57,38.1 20.57,38.35 21.59,39.37 28.96,39.37 v30.48,37.85
ROW_CLK_LV  (via drill 0.38)
  Top 0.305: v15.24,12.7 14.82,13.12 R12.1 14.82,17.85 Q4.2 | v166.37,19.05 166.19,18.87 U3.9
  Bottom 0.305: v15.24,12.7 16,11.94 16,2.79 16.76,2.03 134.37,2.03 141.99,9.65 160.27,9.65 162.81,12.19 162.81,17.27 164.59,19.05 v166.37,19.05
ROW_HIGH_DRV_EN  (via drill 0.38)
  Top 0.305: U7.14 22.23,46.86 v22.1,46.99 | 47.5,46.74 v47.5,46.99 47.62,46.86 U10.14 | U4.3 29.72,16.56 29.72,17.78 29.3,18.2 R35.1 24.13,17.78 v22.86,16.51
  Bottom 0.305: v47.5,46.99 46.23,48.26 32.26,48.26 29.21,45.21 25.91,45.21 24.13,46.99 v22.1,46.99 20.32,46.99 19.05,48.26 17.53,48.26 16.26,46.99 16.26,40.89 10.92,35.56 10.92,32 12.7,30.23 20.32,30.23 21.34,29.21 21.34,18.03 v22.86,16.51
ROW_HIGH_DRV_EN_CTL
  Top 0.305: U4.1 27.3,14.61 28.7,13.21 30.99,13.21 | U4.5 32.38,14.61 30.99,13.21 | 30.99,13.21 37.34,13.21 38.1,13.97 38.1,19.05 39.2,20.15 Q6.3 41.06,21 R18.1
ROW_HIGH_DRV_EN_CTL_LV  (via drill 0.38)
  Top 0.305: v43.18,12.7 42.76,13.12 R14.1 42.76,17.85 Q6.2 | 163.76,20.07 U3.10 167.46,20.14 v167.64,20.32
  Bottom 0.305: v43.18,12.7 44.45,11.43 44.45,3.81 45.47,2.79 134.11,2.79 141.73,10.41 160.02,10.41 162.05,12.45 162.05,17.53 164.85,20.32 v167.64,20.32
ROW_LOW_DRV_EN  (via drill 0.38)
  Top 0.305: U4.10 32.38,24.77 31.75,25.4 | U9.8 41.27,33.66 41.91,33.02 41.91,27.94 40.64,26.67 33.02,26.67 31.75,25.4 | U6.8 15.88,33.66 16.51,33.02 v18.29,33.02 | 30.48,26.67 31.75,25.4 | v30.48,33.02 30.48,26.67 | R36.1 30.48,26.67
  Bottom 0.305: v18.29,33.02 v30.48,33.02
ROW_LOW_DRV_EN_CTL
  Top 0.305: U4.6 U4.9 33.66,24.77 34.29,25.4 46.99,25.4 47.84,24.55 R17.1 47.84,21 Q5.3
ROW_LOW_DRV_EN_CTL_LV  (via drill 0.38)
  Top 0.305: v46.99,12.7 47.84,13.55 R13.1 47.84,17.85 Q5.2 | v166.37,21.59 166.19,21.41 U3.11
  Bottom 0.305: v46.99,12.7 46.48,12.7 45.21,11.43 45.21,4.06 45.72,3.56 133.86,3.56 141.48,11.18 159.77,11.18 161.29,12.7 161.29,17.78 165.1,21.59 v166.37,21.59
ROW_S_IN  (via drill 0.38)
  Top 0.305: v18.54,37.34 18.29,37.59 9.91,37.59 9.53,37.21 U6.3 9.53,24.77 8.04,23.28 R15.1 8.04,21 Q3.3 | 22.35,37.85 v22.35,38.1 22.23,37.97 U7.3
  Bottom 0.305: v18.54,37.34 21.59,37.34 v22.35,38.1
ROW_S_IN_LV  (via drill 0.38)
  Top 0.305: Q3.2 9.74,17.85 R11.1 9.74,13.12 11.43,11.43 v13.97,11.43 | v167.64,17.78 167.46,17.6 U3.8
  Bottom 0.305: v13.97,11.43 15.24,10.16 15.24,2.54 16.51,1.27 134.62,1.27 142.24,8.89 160.53,8.89 163.58,11.94 163.58,16.51 164.85,17.78 v167.64,17.78
RTS
  Top 0.305: Q2.2 Q1.1 176.04,22.86 175.26,22.86 | U2.2 176.21,18.1 175.26,19.05 175.26,22.86 | R3.1 171.87,24.98 172.72,24.13 172.72,22.86 175.26,22.86
SIG_SW1
  Top 0.254: J7.P$1 112.39,10.79 113.67,12.06 123.19,12.06 124.46,13.34 R21.1 126.78,15.24 135.89,15.24 139.06,18.41 142.88,18.41 143.69,17.6 U3.31
SIG_SW2
  Top 0.254: J7.P$2 113.67,7.62 113.67,10.16 114.94,11.43 128.91,11.43 130.81,13.34 R20.1 131.23,13.76 132.08,14.61 136.53,14.61 139.7,17.78 142.24,17.78 144.96,15.06 U3.33
SIG_SW3
  Top 0.254: J7.P$3 109.86,15.24 111.12,16.51 128.91,16.51 130.81,18.41 R10.1 132.5,19.68 143.51,19.68 143.97,20.14 U3.29
SIG_SW4
  Top 0.254: J7.P$4 111.12,7.62 111.12,11.43 112.39,12.7 117.47,12.7 118.11,13.34 R8.1 121.07,15.88 135.25,15.88 138.43,19.05 143.51,19.05 143.69,18.87 U3.30
SIG_SW5
  Top 0.254: J7.P$5 107.31,16.51 108.58,17.78 117.47,17.78 118.11,18.41 R7.1 121.07,20.95 142.24,20.95 143.97,22.68 U3.27
SIG_SW6
  Top 0.254: J7.P$6 108.58,7.62 108.58,15.88 109.86,17.14 123.19,17.14 124.46,18.41 R6.1 126.78,20.32 142.88,20.32 143.97,21.41 U3.28
VBUS
  Top 0.305: J1.1 179.04,5.11 176.53,7.62 176.53,10.92 177.04,11.43 177.8,11.43 179.07,12.7 179.07,13.97 180.66,15.56 U2.15

### Text on the board
tPlace: K7NVH FLIPDOT DRIVER V1.0 2024-07